# EAGLE design RpiServoStepper_v3 (EAGLE 6.3)
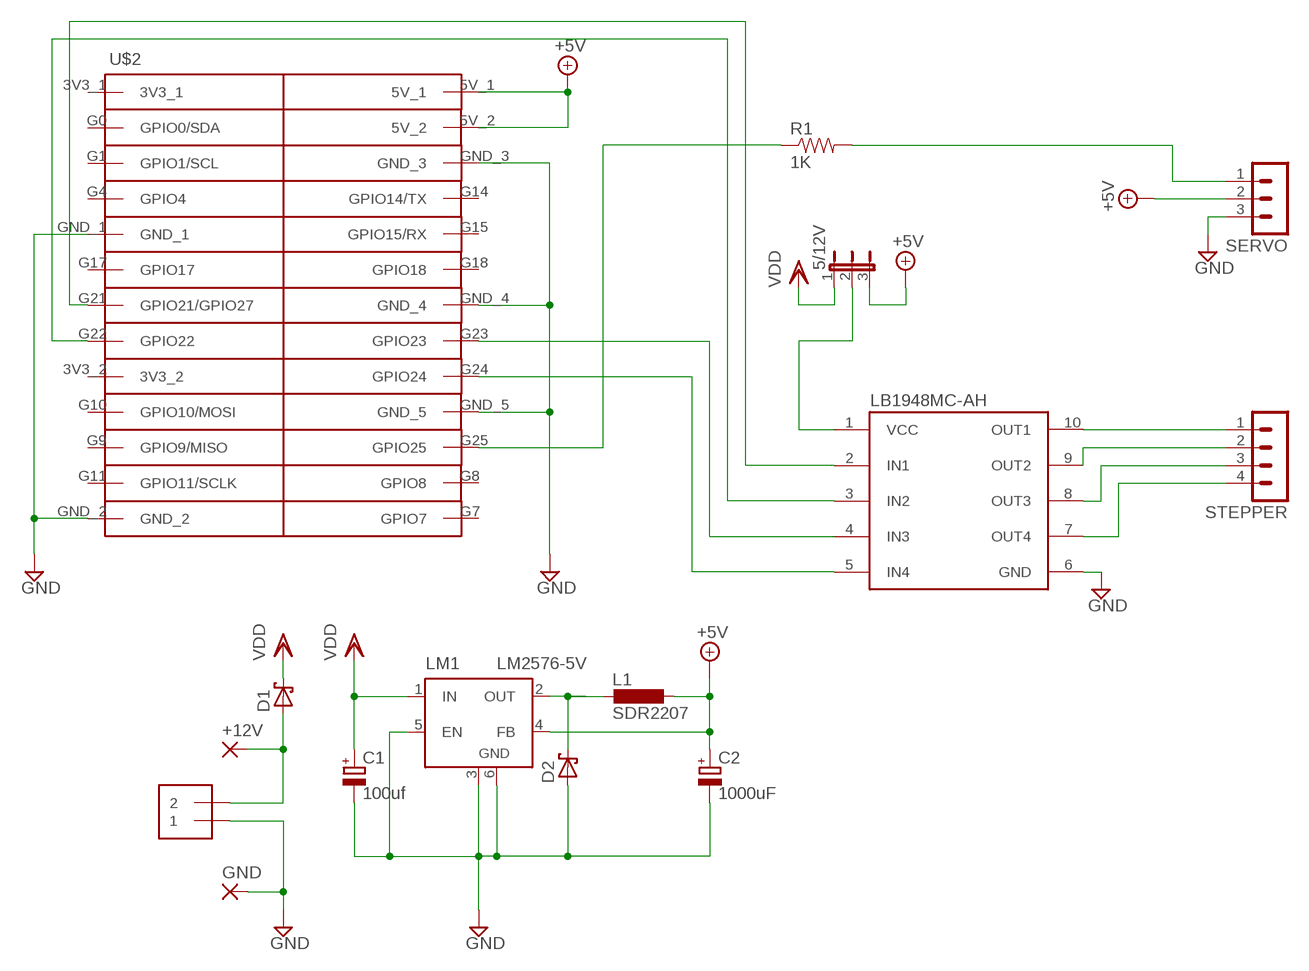
[diagram p0: schematic, sheet 1]

## Parts
5/12V  JP2E  [JP2]
+12V  3,81/1,4  [3,81/1,4]
C1  100uf  CPOL-EUE  [PANASONIC_E]
C2  1000uF  CPOL-EUG  [PANASONIC_G]
D1  SCHOTTKY-DIODESMC  [SMC]
D2  SCHOTTKY-DIODESMC  [SMC]
GND  3,81/1,4  [3,81/1,4]
J1  1X2-3.5MM  [3.5MMTERM]
L1  SDR2207  [SM]
LB1948MC-AH  LB1948MC-AH  [SOIC-10]
LM1  LM2576-5V  LM2596S  [TO263-5]
R1  1K  RESISTOR1206  [1206]
SERVO  MA03-1  [MA03-1]
STEPPER  MA04-1  [MA04-1]
U$2  CONNECTEUR_RPI  [26PIN]

## Nets
+5V: 5/12V.3 C2.+ L1.P$2 LM1.4(FB) SERVO.2 U$2.5V_1 U$2.5V_2
GND: C1.- C2.- D2.A GND.1(P) J1.1 LB1948MC-AH.6(GND) LM1.3(GND) LM1.5(EN) LM1.6(GND) SERVO.3 U$2.GND_1 U$2.GND_2 U$2.GND_3 U$2.GND_4 U$2.GND_5
N$1: LB1948MC-AH.10(OUT1) STEPPER.1
N$2: LB1948MC-AH.9(OUT2) STEPPER.2
N$3: LB1948MC-AH.8(OUT3) STEPPER.3
N$4: LB1948MC-AH.7(OUT4) STEPPER.4
N$5: +12V.1(P) D1.A J1.2
N$6: D2.C L1.P$1 LM1.2(OUT)
N$7: LB1948MC-AH.2(IN1) U$2.G21(GPIO21/GPIO27)
N$8: LB1948MC-AH.3(IN2) U$2.G22(GPIO22)
N$10: LB1948MC-AH.5(IN4) U$2.G24(GPIO24)
N$11: R1.1 U$2.G25(GPIO25)
N$14: LB1948MC-AH.4(IN3) U$2.G23(GPIO23)
N$16: 5/12V.2 LB1948MC-AH.1(VCC)
N$17: R1.2 SERVO.1
VDD: 5/12V.1 C1.+ D1.C LM1.1(IN)
Unconnected: U$2.3V3_1 U$2.3V3_2 U$2.G0(GPIO0/SDA) U$2.G1(GPIO1/SCL) U$2.G4(GPIO4) U$2.G7(GPIO7) U$2.G8(GPIO8) U$2.G9(GPIO9/MISO) U$2.G10(GPIO10/MOSI) U$2.G11(GPIO11/SCLK) U$2.G14(GPIO14/TX) U$2.G15(GPIO15/RX) U$2.G17(GPIO17) U$2.G18(GPIO18)

## Library data of the parts
5/12V = jumper:JP2E: JUMPER
+12V GND = wirepad:3,81/1,4: THROUGH-HOLE PAD
C1 C2 = rcl:CPOL-EU: POLARIZED CAPACITOR, European symbol
D1 D2 = diode:SCHOTTKY-DIODE: Schottky Diode
J1 = adafruit (2):1X2: 3.5mm Terminal block http://www.ladyada.net/library/pcb/eaglelibrary.html
L1 = bourns-inductor:SDR2207
LB1948MC-AH = LB1948MC:LB1948MC-AH
LM1 = linear:LM2596S: STEP-DOWN VOLTAGE REGULATOR
R1 = SparkFun-Passives:RESISTOR: Resistor Basic schematic elements and footprints for 0603, 1206, and PTH resistors.
SERVO = con-lstb:MA03-1: PIN HEADER; OC_FARNELL: unknown; OC_NEWARK: unknown
STEPPER = con-lstb:MA04-1: PIN HEADER; OC_FARNELL: unknown; OC_NEWARK: unknown
U$2 = Rpi:CONNECTEUR_RPI

## Board
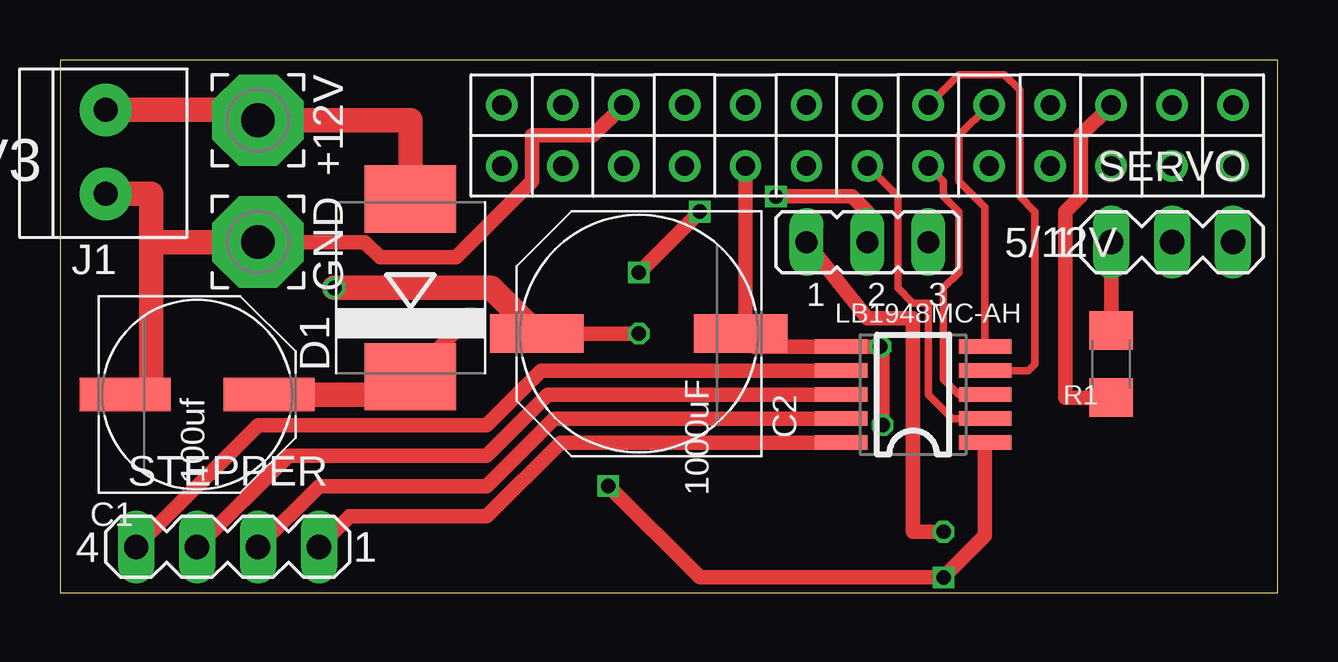
[diagram p1: board, top side]
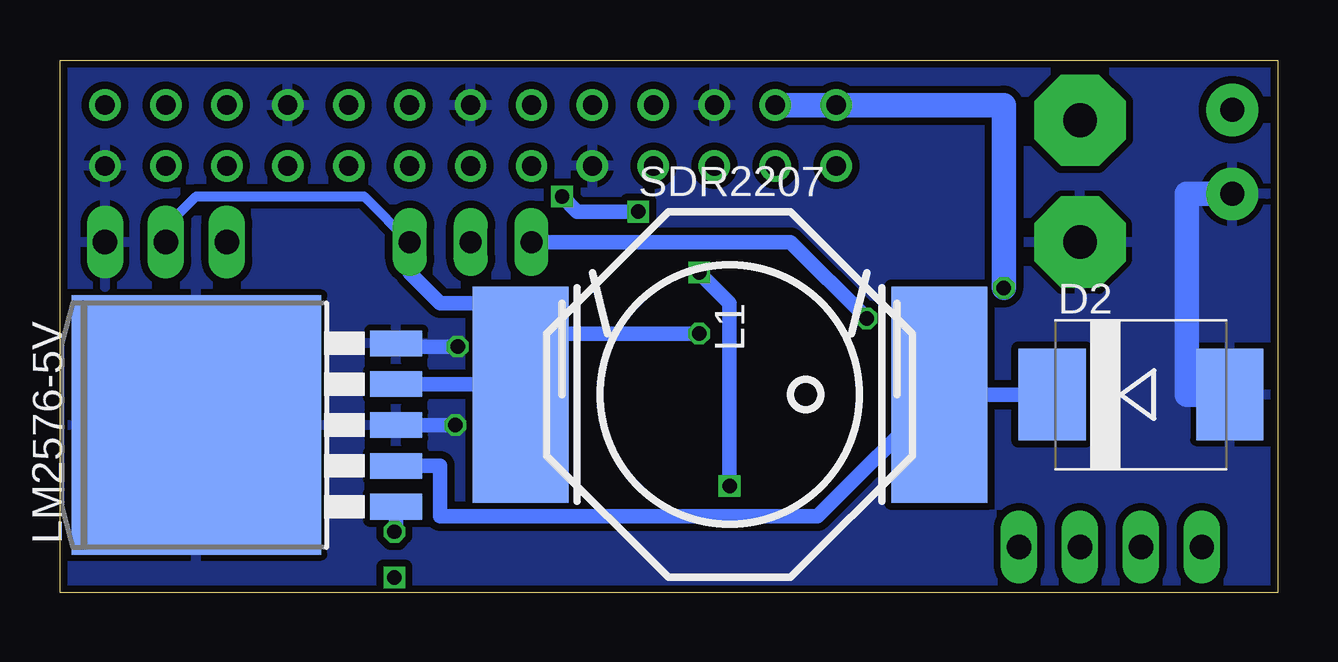
[diagram p2: board, bottom side, seen from below]

Size 50.77 x 22.2 mm. Coordinates in mm from the lower left corner, seen from the top.
Outline: 0,0 50.77,0 50.77,22.2 0,22.2 0,0
Copper layers (1*16): Top 0.035mm / dielectric 1.5mm / Bottom 0.035mm
Design rules "ITEADstudio_DRC": minimum track width 6mil, minimum drill 12mil, track to track 6mil, track to pad 6mil, pad to pad 6mil, via to via 6mil, smd to smd 0mil, copper to edge 10mil, drill to drill 10mil, minimum pad ring 10mil, minimum via ring 6mil, stop-mask expansion 2mil, vias tented up to drill 100mil, thermal gap 10mil

### Footprints (pad centres in the part's own frame; a part is rotated, then mirrored left to right if it is on the bottom)
JP2 = drill 0.914 long: 1 -2.54,0; 2 0,0; 3 2.54,0
3,81/1,4 = drill 1.397 pad 3.81 octagon: 1 0,0
PANASONIC_E = smd 3.8 x 1.4: + 3,0; - -3,0
PANASONIC_G = smd 3.9 x 1.6: + 4.25,0; - -4.25,0
SMC = smd 2.8 x 3.8: A 3.7,0; C -3.7,0
3.5MMTERM = drill 1 pad 2.184: 1 1.8,0; 2 -1.7,0
SM = smd 4 x 9: P$1 -8.74,0; P$2 8.72,0
SOIC-10 = smd 2.2 x 0.6: 1 -3,2; 2 -3,1; 3 -3,0; 4 -3,-1; 5 -3,-2; 6 3,-2; 7 3,-1; 8 3,0; 9 3,1; 10 3,2
TO263-5 = smd 1.067 x 2.159: 1 -3.404,-5.791; 2 -1.702,-5.791; 3 0,-5.791; 4 1.702,-5.791; 5 3.404,-5.791 | smd 10.8 x 10.41: 6 0,2.54
1206 = smd 1.6 x 1.8: 1 -1.4,0; 2 1.4,0
MA03-1 = drill 1.016 long: 1 -2.54,0; 2 0,0; 3 2.54,0
MA04-1 = drill 1.016 long: 1 -3.81,0; 2 -1.27,0; 3 1.27,0; 4 3.81,0
26PIN = drill 0.8: 3V3_1 -1.27,15.24; 3V3_2 -1.27,-5.08; 5V_1 1.27,15.24; 5V_2 1.27,12.7; G0 -1.27,12.7; G1 -1.27,10.16; G4 -1.27,7.62; G7 1.27,-15.24; G8 1.27,-12.7; G9 -1.27,-10.16; G10 -1.27,-7.62; G11 -1.27,-12.7; G14 1.27,7.62; G15 1.27,5.08; G17 -1.27,2.54; G18 1.27,2.54; G21 -1.27,0; G22 -1.27,-2.54; G23 1.27,-2.54; G24 1.27,-5.08; G25 1.27,-10.16; GND_1 -1.27,5.08; GND_2 -1.27,-15.24; GND_3 1.27,10.16; GND_4 1.27,0; GND_5 1.27,-7.62

### Placement (x,y rotation side)
5/12V  33.66,14.6 0 top
+12V  8.26,19.69 270 top
C1  5.71,8.26 0 top
C2  24.13,10.8 180 top
D1  14.61,12.7 90 top
D2  5.71,8.26 0 bottom
GND  8.26,14.6 270 top
J1  1.91,18.41 270 top
L1  22.86,8.26 180 bottom
LB1948MC-AH  35.56,8.26 180 top
LM1  42.55,6.98 90 bottom
R1  43.81,9.52 90 top
SERVO  46.35,14.6 0 top
STEPPER  6.99,1.91 180 top
U$2  33.66,19.05 90 top

### Tracks (layer width: path | path; a pad name or v marks a point on that pad's centre or on a via)
+5V  (via drill 0.6)
  Top 0.61: C2.+ v24.13,10.8
  Top 1.016: 19.68,10.8 C2.+ 17.98,12.7 v11.43,12.7
  Bottom 0.406: SERVO.2 46.35,15.24 45.09,16.51 38.1,16.51 5/12V.3
  Bottom 0.61: 32.01,8.69 L1.P$2 31.11,8.72 31.11,10.16 33.02,12.06 34.92,12.06 36.2,13.34 5/12V.3 | 32.01,8.69 LM1.4 | v24.13,10.8 31.75,10.8 32.01,10.53 32.01,8.69
  Bottom 1.016: U$2.5V_2 U$2.5V_1 11.43,20.32 v11.43,12.7
GND  (via drill 0.6)
  Top 0.61: v34.29,6.98 34.29,10.16 v34.2,10.26 LB1948MC-AH.6 28.92,10.26 C2.- 28.57,10.99 U$2.GND_1 | GND.1 12.7,14.6 13.34,13.97 16.51,13.97 19.68,17.15 19.68,19.05 22.23,19.05 U$2.GND_3
  Top 1.016: J1.1 3.81,16.62 3.81,14.6 | 3.81,14.6 3.81,8.26 C1.- | GND.1 3.81,14.6
  Bottom 0.61: LM1.3 v34.29,6.98 | LM1.5 36.62,10.26 v34.2,10.26
  Bottom 1.016: D2.A 3.81,8.26 3.81,16.62 J1.1
  pour Bottom (isolate 0.305): 52.07,24.77 -1.27,23.49 -1.27,-28.57 53.34,-28.57
N$1
  Top 0.61: STEPPER.1 12.06,3.18 17.78,3.18 20.86,6.26 LB1948MC-AH.10
N$2
  Top 0.61: STEPPER.2 10.79,4.45 17.78,4.45 20.59,7.26 LB1948MC-AH.9
N$3
  Top 0.61: STEPPER.3 9.53,5.72 17.78,5.72 20.32,8.26 LB1948MC-AH.8
N$4
  Top 0.61: STEPPER.4 8.26,6.98 17.78,6.98 20.05,9.26 LB1948MC-AH.7
N$5
  Top 1.016: J1.2 7.83,20.12 +12V.1 14.61,19.69 D1.A
N$6
  Bottom 0.61: D2.C L1.P$1 19.2,3.18 34.92,3.18 34.92,5.28 LM1.2
N$7
  Top 0.305: LB1948MC-AH.2 37.2,7.26 36.2,8.26 36.2,12.06 35.56,12.06 34.92,12.7 34.92,16.51 U$2.G21
N$8
  Top 0.305: LB1948MC-AH.3 37.47,8.26 36.83,8.89 36.83,12.7 37.47,13.34 37.47,15.88 36.83,16.51 36.83,17.15 U$2.G22
N$10
  Top 0.305: LB1948MC-AH.5 38.56,16.05 37.47,17.15 37.47,19.05 U$2.G24
N$11
  Top 0.61: R1.1 41.91,8.12 41.91,15.88 42.55,16.51 42.55,19.05 U$2.G25
N$14
  Top 0.305: LB1948MC-AH.4 40.37,9.26 40.64,9.52 40.64,15.88 40.01,16.51 40.01,20.95 39.37,21.59 37.47,21.59 U$2.G23
N$16  (via drill 0.6)
  Top 0.61: v24.13,13.34 v26.67,15.88 | v29.84,16.51 33.02,16.51 33.66,15.88 5/12V.2 | LB1948MC-AH.1 38.56,2.37 v36.83,0.64 26.67,0.64 v22.86,4.45
  Bottom 0.61: v22.86,4.45 22.86,12.06 v24.13,13.34 | v26.67,15.88 29.21,15.88 v29.84,16.51
N$17
  Top 0.61: SERVO.1 R1.2
VDD  (via drill 0.6)
  Top 0.61: 5/12V.1 33.66,11.43 35.56,11.43 35.56,2.54 v36.83,2.54 | D1.C 17.04,11.43 v17.14,11.43
  Top 1.016: C1.+ 14.61,8.26 D1.C
  Bottom 0.61: v36.83,2.54 36.75,2.62 LM1.1 | v17.14,11.43 20.32,14.6 5/12V.1

### Text on the board
tPlace: Brice G. | V3
bPlace: Projet RA | UCP